# Altium project deserialize.PrjPcb
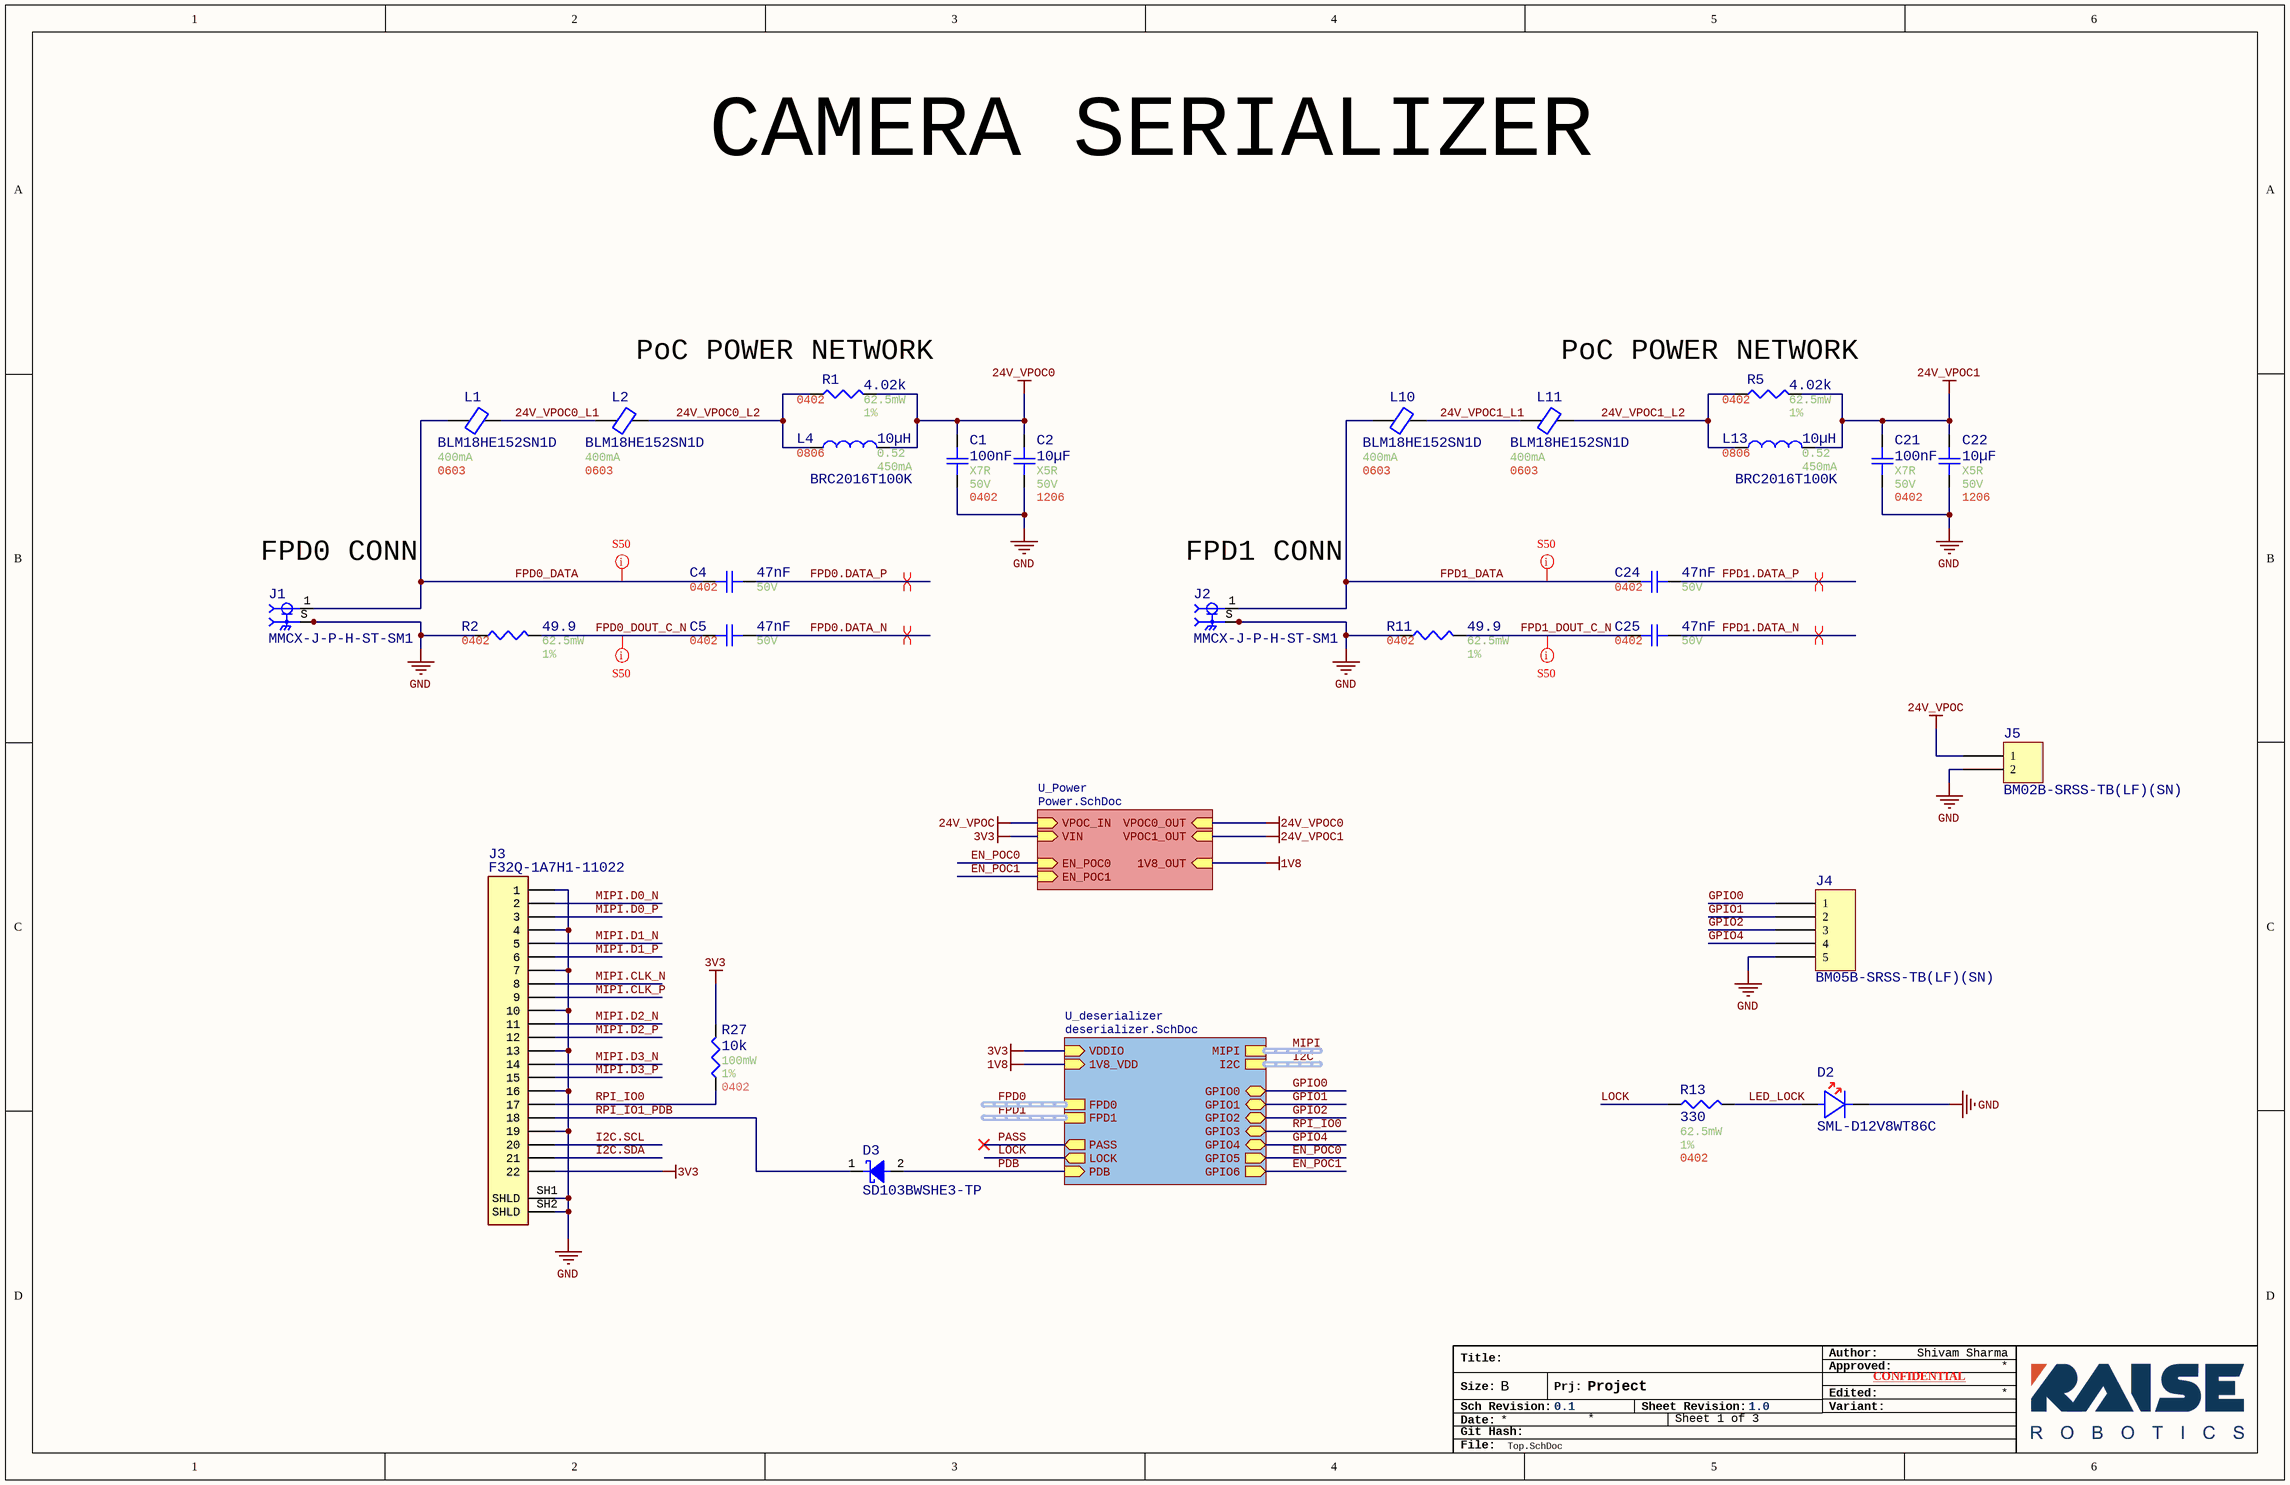
[diagram p0: Top.SchDoc]
SchRevision: 0.1; RR_PlaceNear: [{"paramVis":true,"a":{"refdes":"C6","srcUid":"OYVOCBFH","pin":"2"},"b":{"refdes":"U2","srcUid":"WNTCGATW","pin":"26"},"mm":5},{"paramVis":true,"a":{"refdes":"C7","srcUid":"CVMGOHLT","pin":"2"},"b":{"refdes":"U2","srcUid":"WNTCGATW","pin":"26"},"mm":5},{"paramVis":true,"a":{"refdes":"C8","srcUid":"TGPROSQA","pin":"2"},"b":{"refdes":"U2","srcUid":"WNTCGATW","pin":"26"},"mm":5},{"paramVis":true,"a":{"refdes":"C9","srcUid":"NERXMEEB","pin":"2"},"b":{"refdes":"U2","srcUid":"WNTCGATW","pin":"15"},"mm":5},{"paramVis":true,"a":{"refdes":"C10","srcUid":"PVQVEPHI","pin":"2"},"b":{"refdes":"U2","srcUid":"WNTCGATW","pin":"15"},"mm":5},{"paramVis":true,"a":{"refdes":"C11","srcUid":"IXZAQWUA","pin":"2"},"b":{"refdes":"U2","srcUid":"WNTCGATW","pin":"15"},"mm":5},{"paramVis":true,"a":{"refdes":"C12","srcUid":"SJIUUMFM","pin":"2"},"b":{"refdes":"U2","srcUid":"WNTCGATW","pin":"10"},"mm":5},{"paramVis":true,"a":{"refdes":"C13","srcUid":"VZIHORBA","pin":"2"},"b":{"refdes":"U2","srcUid":"WNTCGATW","pin":"10"},"mm":5},{"paramVis":true,"a":{"refdes":"C14","srcUid":"JKNMRYLV","pin":"2"},"b":{"refdes":"U2","srcUid":"WNTCGATW","pin":"10"},"mm":5},{"paramVis":true,"a":{"refdes":"C16","srcUid":"VAZDDXWB","pin":"2"},"b":{"refdes":"U2","srcUid":"WNTCGATW","pin":"25"},"mm":5},{"paramVis":true,"a":{"refdes":"C15","srcUid":"YTLVSWDQ","pin":"2"},"b":{"refdes":"U2","srcUid":"WNTCGATW","pin":"25"},"mm":5},{"paramVis":true,"a":{"refdes":"C18","srcUid":"XVSOHREA","pin":"2"},"b":{"refdes":"U2","srcUid":"WNTCGATW","pin":"16"},"mm":5},{"paramVis":true,"a":{"refdes":"C17","srcUid":"DALIXIOP","pin":"2"},"b":{"refdes":"U2","srcUid":"WNTCGATW","pin":"16"},"mm":5},{"paramVis":true,"a":{"refdes":"C20","srcUid":"WIZCYGLQ","pin":"2"},"b":{"refdes":"U2","srcUid":"WNTCGATW","pin":"11"},"mm":5},{"paramVis":true,"a":{"refdes":"C19","srcUid":"YZYSSQBB","pin":"2"},"b":{"refdes":"U2","srcUid":"WNTCGATW","pin":"11"},"mm":5},{"paramVis":true,"a":{"refdes":"C58","srcUid":"BEWWQTYO","pin":"1"},"b":{"refdes":"U2","srcUid":"WNTCGATW","pin":"9"},"mm":5},{"paramVis":true,"a":{"refdes":"C58","srcUid":"BEWWQTYO","pin":"2"},"b":{"refdes":"U2","srcUid":"WNTCGATW","pin":"11"},"mm":5}]; ProjectTitle: Project; PCBRevision: 0.0.1
2 sheets, 56 parts. Net scope: hierarchical (ports join the sheet entries above them; power ports are global).
Board file: Camera.PcbDoc
Sheets:
  Top.SchDoc
    U_Power = Power.SchDoc

## Sheet Top.SchDoc
size 431 x 279 mm; Author: Shivam Sharma; SheetNumber: 1; SheetTotal: 3; SheetRevision: 1.0

### Parts
C1  value 100nF  Temperature Coefficient: X7R  Voltage Rating: 50V  Case/Package: 0402  [Generic 0402 capacitor]  (hidden comment: GRT155R71H104KE01D)
C2  value 10µF  Temperature Coefficient: X5R  Voltage Rating: 50V  Case/Package: 1206  [Generic 1206 Capacitor]  (hidden comment: CL31A106MBHNNNE)
C4  value 47nF  Voltage Rating: 50V  Case/Package: 0402  [Generic 0402 capacitor]  (hidden comment: GRM155R71H473KE14D)
C5  value 47nF  Voltage Rating: 50V  Case/Package: 0402  [Generic 0402 capacitor]  (hidden comment: GRM155R71H473KE14D)
C21  value 100nF  Temperature Coefficient: X7R  Voltage Rating: 50V  Case/Package: 0402  [Generic 0402 capacitor]  (hidden comment: GRT155R71H104KE01D)
C22  value 10µF  Temperature Coefficient: X5R  Voltage Rating: 50V  Case/Package: 1206  [Generic 1206 Capacitor]  (hidden comment: CL31A106MBHNNNE)
C24  value 47nF  Voltage Rating: 50V  Case/Package: 0402  [Generic 0402 capacitor]  (hidden comment: GRM155R71H473KE14D)
C25  value 47nF  Voltage Rating: 50V  Case/Package: 0402  [Generic 0402 capacitor]  (hidden comment: GRM155R71H473KE14D)
D2  SML-D12V8WT86C  [FP-SML-D12-MFG]
D3  SD103BWSHE3-TP  [SOD-323]
J1  MMCX-J-P-H-ST-SM1  [MMCX-J-P-H-ST-SM1]
J2  MMCX-J-P-H-ST-SM1  [MMCX-J-P-H-ST-SM1]
J3  F32Q-1A7H1-11022  [F32Q-1A7H1-11022]
J4  BM05B-SRSS-TB(LF)(SN)  [JST BM05B-SRSS-TB]
J5  BM02B-SRSS-TB(LF)(SN)  [JST BM02B-SRSS-TB]
L1  BLM18HE152SN1D  Current Rating: 400mA  Case/Package: 0603  [0603_1.6x0.8x0.8mm_IND]
L2  BLM18HE152SN1D  Current Rating: 400mA  Case/Package: 0603  [0603_1.6x0.8x0.8mm_IND]
L4  BRC2016T100K  value 10µH  DCR: 0.52  Current Rating: 450mA  Case/Package: 0806  [0805_2.0x1.6x1.6mm_IND]
L10  BLM18HE152SN1D  Current Rating: 400mA  Case/Package: 0603  [0603_1.6x0.8x0.8mm_IND]
L11  BLM18HE152SN1D  Current Rating: 400mA  Case/Package: 0603  [0603_1.6x0.8x0.8mm_IND]
L13  BRC2016T100K  value 10µH  DCR: 0.52  Current Rating: 450mA  Case/Package: 0806  [0805_2.0x1.6x1.6mm_IND]
R1  value 4.02k  Power: 62.5mW  Tolerance: 1%  Case/Package: 0402  [Generic 0402 Resistor]  (hidden comment: RCA04024K02FKEDSR)
R2  value 49.9  Power: 62.5mW  Tolerance: 1%  Case/Package: 0402  [Generic 0402 Resistor]  (hidden comment: RMCA0402FT49R9-HP)
R5  value 4.02k  Power: 62.5mW  Tolerance: 1%  Case/Package: 0402  [Generic 0402 Resistor]  (hidden comment: RCA04024K02FKEDSR)
R11  value 49.9  Power: 62.5mW  Tolerance: 1%  Case/Package: 0402  [Generic 0402 Resistor]  (hidden comment: RMCA0402FT49R9-HP)
R13  value 330  Power: 62.5mW  Tolerance: 1%  Case/Package: 0402  [Generic 0402 Resistor]  (hidden comment: RMCF0402FT330R)
R27  value 10k  Power: 100mW  Tolerance: 1%  Case/Package: 0402  [Generic 0402 Resistor]  (hidden comment: RNCP0402FTD10K0)

### Sub-sheets
U_deserializer = deserializer.SchDoc (file not in this document): MIPI (harness MIPI), I2C (harness I2C), GPIO0 (bidir), GPIO1 (bidir), GPIO2 (bidir), GPIO3 (bidir), GPIO4 (bidir), GPIO5 (out), GPIO6 (out), LOCK (out), PASS (out), 1V8_VDD (in), FPD1 (harness FPD), FPD0 (harness FPD), VDDIO (in), PDB (in)
U_Power = Power.SchDoc: VIN (in), VPOC_IN (in), VPOC1_OUT (in), VPOC0_OUT (in), 1V8_OUT (in), EN_POC0 (in), EN_POC1 (in)

### Nets
1V8: sheet U_deserializer/1V8_VDD, sheet U_Power/1V8_OUT
3V3: J3.22 R27.2 ; sheet U_deserializer/VDDIO, sheet U_Power/VIN
24V_VPOC: J5.1 ; sheet U_Power/VPOC_IN
24V_VPOC0: C1.2 C2.2 L4.2 R1.2 ; sheet U_Power/VPOC0_OUT
24V_VPOC1: C21.2 C22.2 L13.2 R5.2 ; sheet U_Power/VPOC1_OUT
GND: C1.1 C2.1 C21.1 C22.1 D2.1(C) J1.S1 J1.S2 J1.S3 J1.S4 J2.S1 J2.S2 J2.S3 J2.S4 J3.1 J3.4 J3.7 J3.10 J3.13 J3.16 J3.19 J3.SH1(SHLD) J3.SH2(SHLD) J4.5 J5.2 R2.1 R11.1
24V_VPOC0_L1: L1.2 L2.1
24V_VPOC0_L2: L2.2 L4.1 R1.1
24V_VPOC1_L1: L10.2 L11.1
24V_VPOC1_L2: L11.2 L13.1 R5.1
EN_POC0: sheet U_deserializer/GPIO5, sheet U_Power/EN_POC0
EN_POC1: sheet U_deserializer/GPIO6, sheet U_Power/EN_POC1
FPD0.DATA_N: C5.1
FPD0.DATA_P: C4.1
FPD0_DATA: C4.2 J1.1 L1.1
FPD0_DOUT_C_N: C5.2 R2.2
FPD1.DATA_N: C25.1
FPD1.DATA_P: C24.1
FPD1_DATA: C24.2 J2.1 L10.1
FPD1_DOUT_C_N: C25.2 R11.2
GPIO0: J4.1 ; sheet U_deserializer/GPIO0
GPIO1: J4.2 ; sheet U_deserializer/GPIO1
GPIO2: J4.3 ; sheet U_deserializer/GPIO2
GPIO4: J4.4 ; sheet U_deserializer/GPIO4
I2C.SCL: J3.20
I2C.SDA: J3.21
LED_LOCK: D2.2(A) R13.2
LOCK: R13.1 ; sheet U_deserializer/LOCK
MIPI.CLK_N: J3.8
MIPI.CLK_P: J3.9
MIPI.D0_N: J3.2
MIPI.D0_P: J3.3
MIPI.D1_N: J3.5
MIPI.D1_P: J3.6
MIPI.D2_N: J3.11
MIPI.D2_P: J3.12
MIPI.D3_N: J3.14
MIPI.D3_P: J3.15
PASS: sheet U_deserializer/PASS
PDB: D3.2(A) ; sheet U_deserializer/PDB
RPI_IO0: J3.17 R27.1 ; sheet U_deserializer/GPIO3
RPI_IO1_PDB: D3.1(C) J3.18

### Buses and harness runs
harness FPD0 = sheet U_deserializer/FPD0
harness FPD1 = sheet U_deserializer/FPD1
harness I2C = sheet U_deserializer/I2C
harness MIPI = sheet U_deserializer/MIPI

### Layout directives
net class S50: FPD0_DATA, FPD0_DOUT_C_N, FPD1_DATA, FPD1_DOUT_C_N
differential pair: FPD0.DATA_N, FPD0.DATA_P, FPD1.DATA_N, FPD1.DATA_P

### Notes on the sheet
- CAMERA SERIALIZER
- (near R1) PoC POWER NETWORK
- (near R5) PoC POWER NETWORK
- (near J1) FPD0 CONN
- (near J2) FPD1 CONN
- Title:
- Author:
- Approved:
- Size:
- Date:
- Git Hash:
- Sch Revision:
- B
- Prj:
- Sheet Revision:
- Variant:
- Edited:
- CONFIDENTIAL
- File:
- (in symbol CMP-002-00135-2) S

### Library data of the parts
C1 C21 = CMP-001-00084-12: Ceramic Capacitor, Multilayer, Ceramic, 50V, 10% +Tol, 10% -Tol, X7R, 15% TC, 0.1uF, Surface Mount, 0402; Multilayer: Yes; Terminal Finish: Nickel; Capacitor Type: Ceramic; Package Shape: Rectangular; Reach SVHC Compliant: Yes; Max Operating Temperature: 125°C; RoHS Compliant: Yes; Termination: Wraparound; Packaging: Tape and Reel; AECQ: Yes; Pins: 2; Dielectric Material: Ceramic; Min Operating Temperature: -55°C; Tolerance: 10%; Mounting Technology: Surface Mount
C2 C22 = CMP-001-00092-6: Ceramic Capacitor, Multilayer, Ceramic, 50V, 20% +Tol, 20% -Tol, X5R, 15% TC, 10uF, Surface Mount, 1206; AECQ: No; Multilayer: Yes; Reach SVHC Compliant: Yes; Package Shape: Rectangular; Temperature Characteristics Code: X5R; RoHS Compliant: Yes; Max Operating Temperature: 85°C; Mounting Technology: Surface Mount; Capacitor Type: Ceramic; Pins: 2; Packaging: Tape and Reel; Terminal Finish: Nickel; Tolerance: 20%; Termination: Wraparound; Dielectric Material: Ceramic; JESD-609 Code: e3; Min Operating Temperature: -55°C
C4 C5 C24 C25 = CMP-001-00113-1: 50V 47nF X7R ±10% 0402 Multilayer Ceramic Capacitors MLCC - SMD/SMT ROHS; AECQ: No; Mounting Technology: SMD; Tolerance: 10%; Pins: 2; Min Operating Temperature: -55°C; Max Operating Temperature: 125°C; Capacitor Type: Ceramic
D2 = CMP-007-00036-1: Red 630nm LED Indication - Discrete 2.2V 0603 (1608 Metric); Case/Package: 0603; Forward Voltage: 2.2V; Colour: Red; Pins: 2
D3 = CMP-004-00038-1: Rectifier Diode, Schottky, 1 Phase, 1 Element, 0.35A, 30V V(RRM), Silicon; Reverse Recovery Time: 10ns; Forward Voltage: 370mV; Forward Current: 350mA; Min Operating Temperature: -55°C; Max Operating Temperature: 125°C; RoHS Compliant: Yes; Min Breakdown Voltage: 30V; Max Output current: 350mA; Case/Package: SOD-323; Pins: 2
J1 J2 = CMP-002-00135-2: RF / Coaxial Connector, MMCX Coaxial, Straight Jack, Surface Mount Vertical, 50 ohm; Manufacturer: Samtec; Max Current Rating: 1.5A; Voltage Rating: 335V; Gender: Female; Connector Type: MMCX, Socket; Manufacturer Series: MMCX; Length: 3.45mm; Mounting Technology: Surface Mount; Pins: 2; Min Operating Temperature: -65°C; Case/Package: MMCX SMD; Max Operating Temperature: 125°C
J3 = CMP-002-00137-2: FPC/FFC Connector Socket 22 Position 0.5mm Top Contact Solder Right Angle Surface Mount T/R; Manufacturer: Amphenol; Manufacturer Series: F32Q; Connector Type: FPC; Voltage Rating: 50V; Gender: Female; Max Current Rating: 500mA; Max Operating Temperature: 105°C; Length: 20.8mm; Height: 2.9mm; RoHS Compliant: Yes; Pins: 22; Case/Package: 22-ZIF_0.5mm; Width: 5.5mm; Min Operating Temperature: -40°C; Pitch: 0.5mm
J4 = BM05B-SRSS-TB(LF)(SN): CONN HEADER SMD 5POS 1MM; Manufacturer: JST Sales America Inc.; Current Rating (Amps): 0.7A; Material Flammability Rating: UL94 V-0; Number of Positions: 5; Number of Positions Loaded: All; Pitch - Mating: 0.039" (1.00mm); Shrouding: Shrouded - 4 Wall; Style: Board to Cable/Wire; Voltage Rating: 50V; Part Number: BM05B-SRSS-TB(LF)(SN); ComponentLink1Description: Datasheet; ComponentLink1URL: http://www.jst-mfg.com/product/pdf/eng/eSR.pdf; ComponentLink2Description: DigiKey Link; ComponentLink2URL: http://digikey.com/product-detail/en/jst-sales-america-inc/BM05B-SRSS-TB-LF-SN/455-1791-1-ND/926862; Connector Type: Header; Contact Finish - Mating: Tin; Contact Finish - Post: Tin; Contact Material: Copper Alloy; Contact Shape: Square; Contact Type: Male Pin; Fastening Type: Push-Pull; Features: Solder Retention; Insulation Color: Natural; Insulation Height: 0.167" (4.25mm); Insulation Material: Polyamide (PA), Nylon; LastUpdated: 1/12/2020 10:14:00 PM; Lifecycle Status: Active; Minimum Order: 1; Mounting Type: Surface Mount; Number of Rows: 1; Operating Temperature: -25°C ~ 85°C; Packaging: TapeAndReel; PartId: 18; Part Status: Active; Price: 0.35; Series: SR; Supplier 1: DigiKey; Supplier Part Number 1: 455-1791-1-ND; Termination: Solder
J5 = BM02B-SRSS-TB(LF)(SN): CONN HEADER SMD 2POS 1MM; Manufacturer: JST Sales America Inc.; Current Rating (Amps): 0.7A; Material Flammability Rating: UL94 V-0; Number of Positions: 2; Number of Positions Loaded: All; Pitch - Mating: 0.039" (1.00mm); Shrouding: Shrouded - 4 Wall; Style: Board to Cable/Wire; Voltage Rating: 50V; Part Number: BM02B-SRSS-TB(LF)(SN); ComponentLink1Description: Datasheet; ComponentLink1URL: http://www.jst-mfg.com/product/pdf/eng/eSR.pdf; ComponentLink2Description: DigiKey Link; ComponentLink2URL: http://digikey.com/product-detail/en/jst-sales-america-inc/BM02B-SRSS-TB-LF-SN/455-1788-1-ND/926859; Connector Type: Header; Contact Finish - Mating: Tin; Contact Finish - Post: Tin; Contact Material: Copper Alloy; Contact Shape: Square; Contact Type: Male Pin; Fastening Type: Push-Pull; Features: Solder Retention; Insulation Color: Natural; Insulation Height: 0.167" (4.25mm); Insulation Material: Polyamide (PA), Nylon; LastUpdated: 1/12/2020 10:11:04 PM; Lifecycle Status: Active; Minimum Order: 1; Mounting Type: Surface Mount; Number of Rows: 1; Operating Temperature: -25°C ~ 85°C; Packaging: TapeAndReel; PartId: 12; Part Status: Active; Price: 0.22; Series: SR; Supplier 1: DigiKey; Supplier Part Number 1: 455-1788-1-ND; Termination: Solder
L1 L2 L10 L11 = CMP-006-00026-1: Ferrite Beads Multi-Layer 1.5KOhm 25% 100MHz 500mA 500mOhm DCR 0603 T/R; Current - Saturation: 13.3A; AECQ: no; DCR: 20.5m; Shileded: Yes; Height: 800µm; Max Operating Temperature: 125°C; Pins: 2; Tolerance: 25%; Min Operating Temperature: -55°C
L4 L13 = CMP-006-00025-2: IND 10UH 20% 3.1A SHD; Shileded: Yes; Tolerance: 10%; Self Resonant Frequency: 35MHz; Current - Saturation: 3.3A; AECQ: No; Pins: 2; Height: 1.6mm; Min Operating Temperature: -40°C; Max Operating Temperature: 105°C
R1 R5 = CMP-009-00241-1: Fixed Resistor, Metal Glaze/Thick Film, 0.063W, 4020ohm, 50V, 1% +/-Tol, Surface Mount, 0402; Manufacturer Part Number: Blank; AECQ: Yes; Pins: 2; Voltage Rating: 50V; Max Operating Temperature: 155°C; Min Operating Temperature: -55°C; Mounting Technology: SMD
R2 R11 = CMP-009-00240-1: RES, 0402, 49.9 ohm, 1%, 0.1W, AUTO; AECQ: Yes; Voltage Rating: 50V; Min Operating Temperature: -55°C; Mounting Technology: SMD; Manufacturer Part Number: RMCA0402FT49R9-HP; Max Operating Temperature: 155°C; Pins: 2
R13 = CMP-009-00225-1: Res Thick Film 0402 330 Ohm 1% 0.063W ±100ppm/°C Molded SMD Paper T/R; AECQ: Yes; Mounting Technology: Surface Mount; Max Operating Temperature: 155°C; RoHS Compliant: Yes; Pins: 2; Min Operating Temperature: -55°C
R27 = CMP-009-00242-1: Fixed Resistor, Thin Film, 0.1W, 10000ohm, 50V, 1% +/-Tol, 100ppm/Cel, Surface Mount, 0402; Manufacturer Part Number: Blank; AECQ: Yes; Pins: 2; Max Operating Temperature: 155°C; Voltage Rating: 50V; Mounting Technology: SMD; Min Operating Temperature: -55°C

## Sheet Power.SchDoc: POWER
size 431 x 279 mm; SheetNumber: 2; SheetTotal: 3; SheetRevision: 1.0
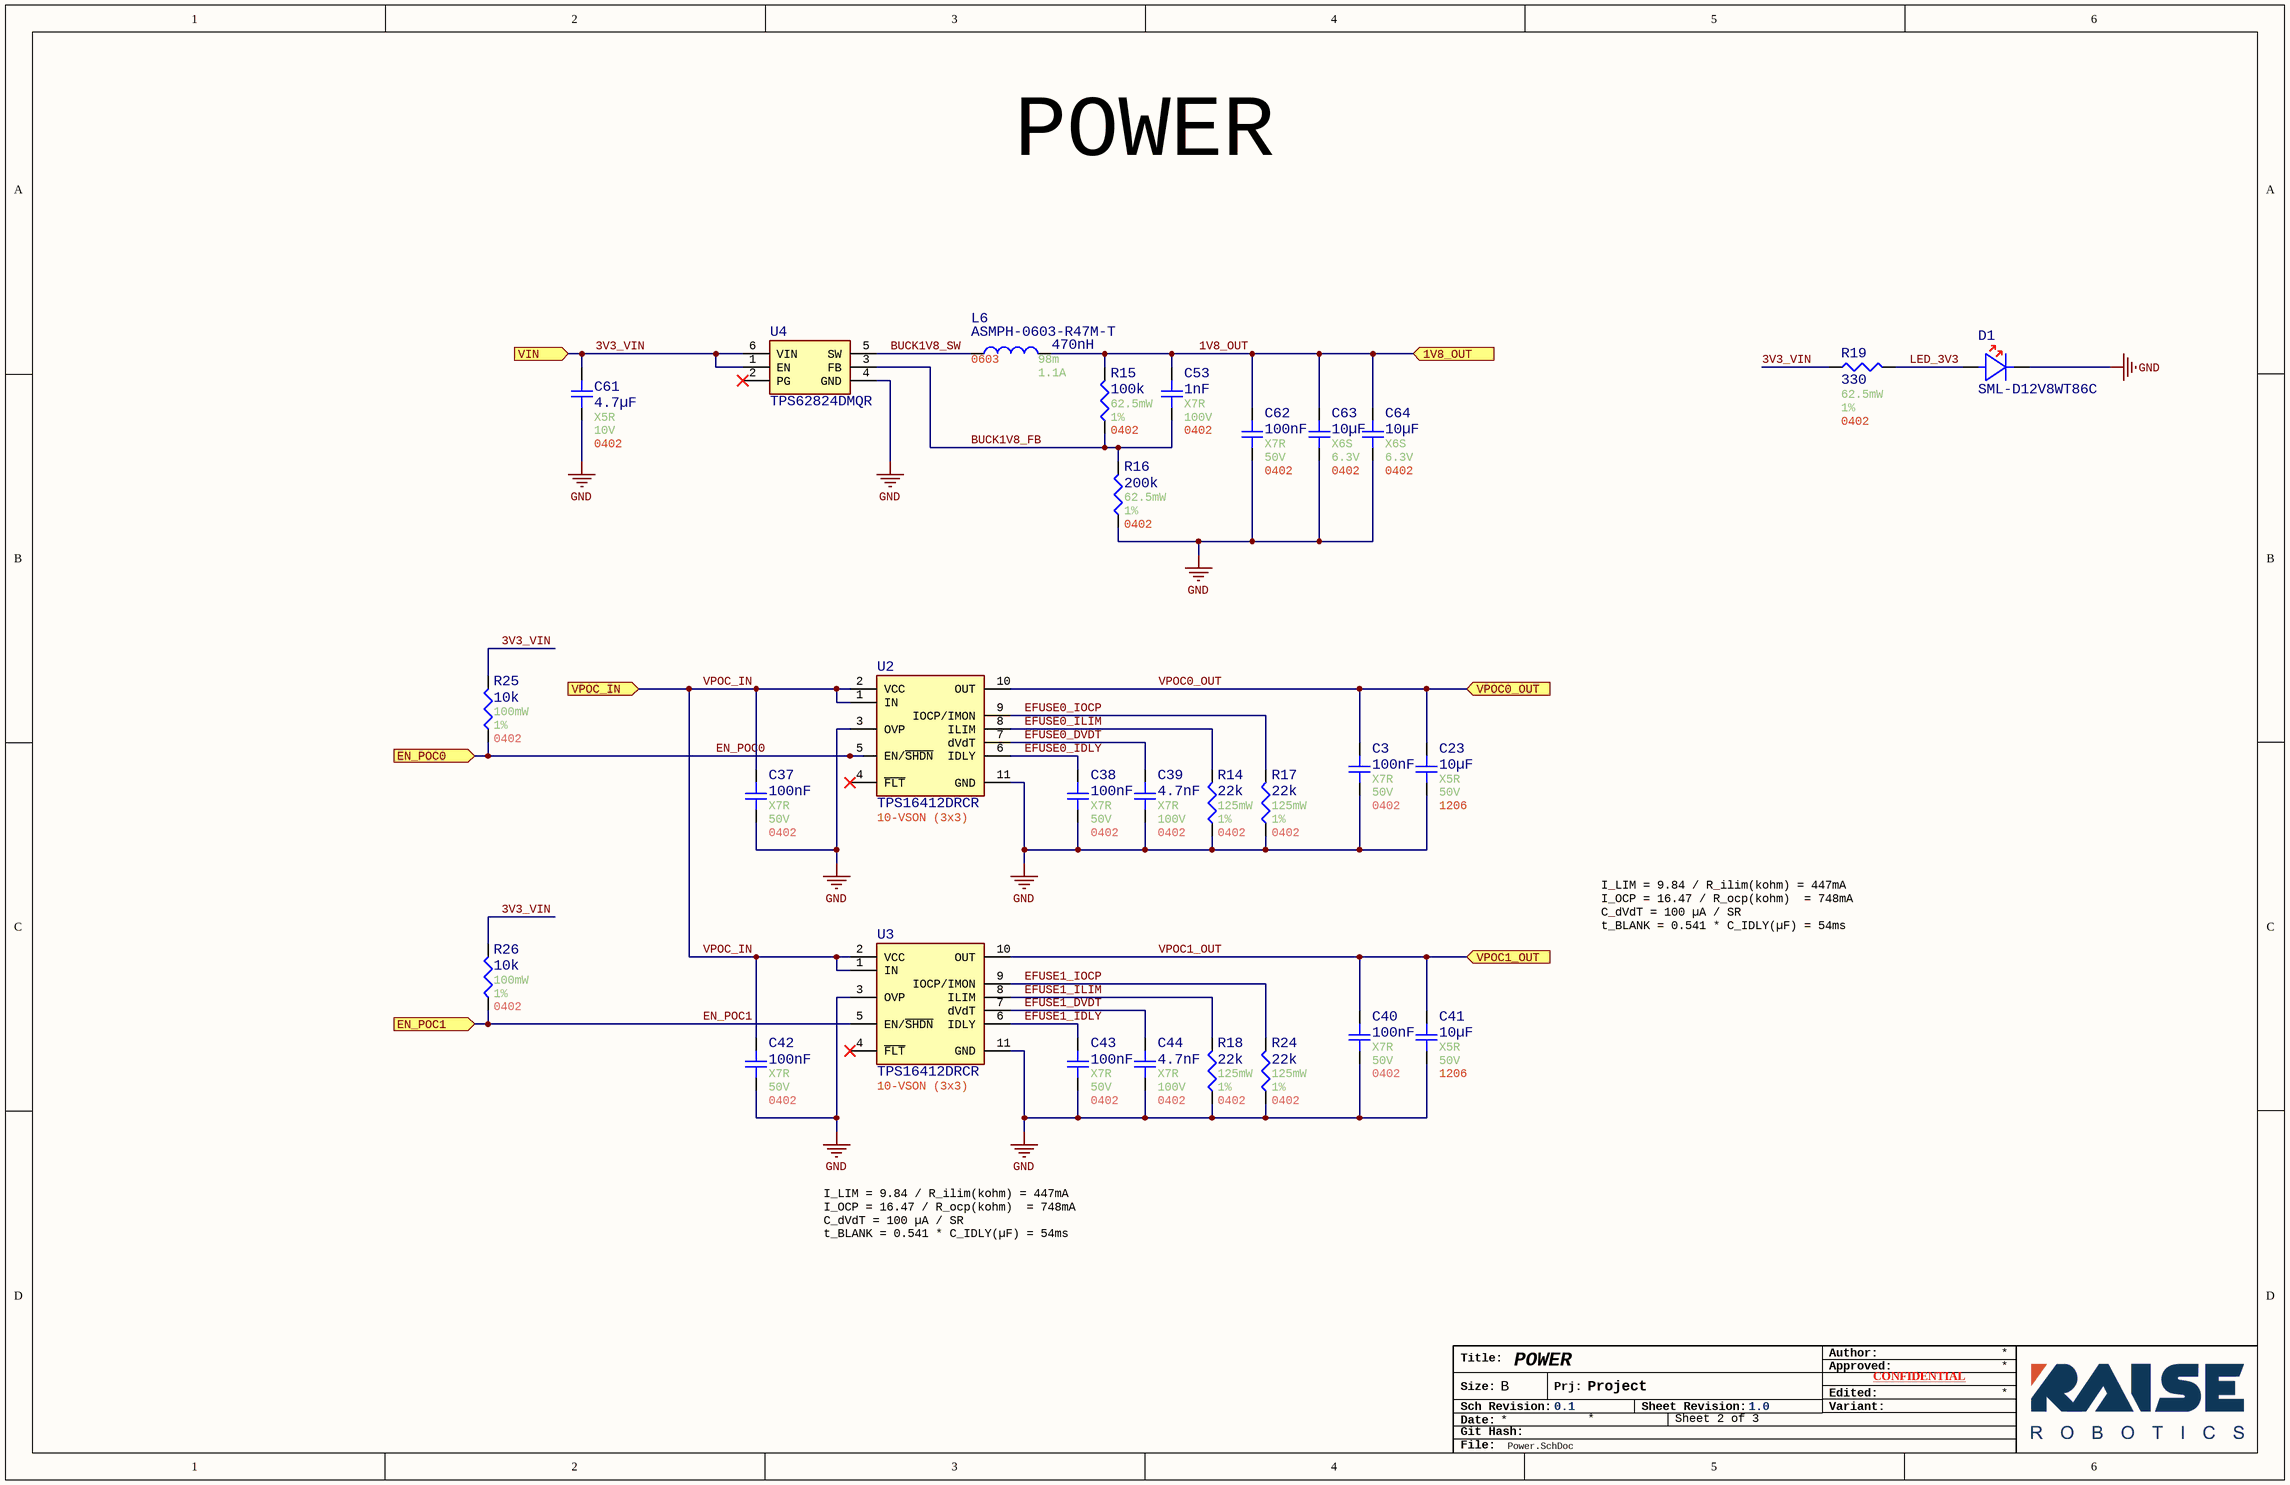
[diagram p1: Power.SchDoc]

### Parts
C3  value 100nF  Temperature Coefficient: X7R  Voltage Rating: 50V  Case/Package: 0402  [Generic 0402 capacitor]  (hidden comment: GRT155R71H104KE01D)
C23  value 10µF  Temperature Coefficient: X5R  Voltage Rating: 50V  Case/Package: 1206  [Generic 1206 Capacitor]  (hidden comment: CL31A106MBHNNNE)
C37  value 100nF  Temperature Coefficient: X7R  Voltage Rating: 50V  Case/Package: 0402  [Generic 0402 capacitor]  (hidden comment: GRT155R71H104KE01D)
C38  value 100nF  Temperature Coefficient: X7R  Voltage Rating: 50V  Case/Package: 0402  [Generic 0402 capacitor]  (hidden comment: GRT155R71H104KE01D)
C39  value 4.7nF  Temperature Coefficient: X7R  Voltage Rating: 100V  Case/Package: 0402  [Generic 0402 capacitor]  (hidden comment: GCM155R72A472KA37D)
C40  value 100nF  Temperature Coefficient: X7R  Voltage Rating: 50V  Case/Package: 0402  [Generic 0402 capacitor]  (hidden comment: GRT155R71H104KE01D)
C41  value 10µF  Temperature Coefficient: X5R  Voltage Rating: 50V  Case/Package: 1206  [Generic 1206 Capacitor]  (hidden comment: CL31A106MBHNNNE)
C42  value 100nF  Temperature Coefficient: X7R  Voltage Rating: 50V  Case/Package: 0402  [Generic 0402 capacitor]  (hidden comment: GRT155R71H104KE01D)
C43  value 100nF  Temperature Coefficient: X7R  Voltage Rating: 50V  Case/Package: 0402  [Generic 0402 capacitor]  (hidden comment: GRT155R71H104KE01D)
C44  value 4.7nF  Temperature Coefficient: X7R  Voltage Rating: 100V  Case/Package: 0402  [Generic 0402 capacitor]  (hidden comment: GCM155R72A472KA37D)
C53  value 1nF  Temperature Coefficient: X7R  Voltage Rating: 100V  Case/Package: 0402  [Generic 0402 capacitor]  (hidden comment: GCM155R72A102KA37J)
C61  value 4.7µF  Temperature Coefficient: X5R  Voltage Rating: 10V  Case/Package: 0402  [Generic 0402 capacitor]  (hidden comment: GRT155R61A475ME13D)
C62  value 100nF  Temperature Coefficient: X7R  Voltage Rating: 50V  Case/Package: 0402  [Generic 0402 capacitor]  (hidden comment: GRT155R71H104KE01D)
C63  value 10µF  Temperature Coefficient: X6S  Voltage Rating: 6.3V  Case/Package: 0402  [Generic 0402 capacitor]  (hidden comment: GRT155C80J106ME13J)
C64  value 10µF  Temperature Coefficient: X6S  Voltage Rating: 6.3V  Case/Package: 0402  [Generic 0402 capacitor]  (hidden comment: GRT155C80J106ME13J)
D1  SML-D12V8WT86C  [FP-SML-D12-MFG]
L6  ASMPH-0603-R47M-T  value 470nH  DCR: 98m  Current Rating: 1.1A  Case/Package: 0603  [0603_1.6x0.8x0.8mm_IND]
R14  value 22k  Power: 125mW  Tolerance: 1%  Case/Package: 0402  [Generic 0402 Resistor]  (hidden comment: AC0402FR-7W22KL)
R15  value 100k  Power: 62.5mW  Tolerance: 1%  Case/Package: 0402  [Generic 0402 Resistor]  (hidden comment: WR04X1003FTL)
R16  value 200k  Power: 62.5mW  Tolerance: 1%  Case/Package: 0402  [Generic 0402 Resistor]  (hidden comment: 560112110041)
R17  value 22k  Power: 125mW  Tolerance: 1%  Case/Package: 0402  [Generic 0402 Resistor]  (hidden comment: AC0402FR-7W22KL)
R18  value 22k  Power: 125mW  Tolerance: 1%  Case/Package: 0402  [Generic 0402 Resistor]  (hidden comment: AC0402FR-7W22KL)
R19  value 330  Power: 62.5mW  Tolerance: 1%  Case/Package: 0402  [Generic 0402 Resistor]  (hidden comment: RMCF0402FT330R)
R24  value 22k  Power: 125mW  Tolerance: 1%  Case/Package: 0402  [Generic 0402 Resistor]  (hidden comment: AC0402FR-7W22KL)
R25  value 10k  Power: 100mW  Tolerance: 1%  Case/Package: 0402  [Generic 0402 Resistor]  (hidden comment: RNCP0402FTD10K0)
R26  value 10k  Power: 100mW  Tolerance: 1%  Case/Package: 0402  [Generic 0402 Resistor]  (hidden comment: RNCP0402FTD10K0)
U2  TPS16412DRCR  Case/Package: 10-VSON (3x3)  [VSON-10_3x3x1.0mm_P0.5mm]
U3  TPS16412DRCR  Case/Package: 10-VSON (3x3)  [VSON-10_3x3x1.0mm_P0.5mm]
U4  TPS62824DMQR  [VSON_HR-6_1.5x1.5x1.0mm_P0.5mm]

### Ports
1V8_OUT (in), EN_POC0 (in), EN_POC1 (in), VIN (in), VPOC0_OUT (in), VPOC1_OUT (in), VPOC_IN (in)

### Nets
1V8_OUT: C53.2 C62.1 C63.2 C64.2 L6.2 R15.2 ; port 1V8_OUT  [project net 1V8]
3V3_VIN: C61.1 R19.1 R25.2 R26.2 U4.1(EN) U4.6(VIN) ; port VIN  [project net 3V3]
GND: C3.1 C23.1 C37.1 C38.1 C39.1 C40.1 C41.1 C42.1 C43.1 C44.1 C61.2 C62.2 C63.1 C64.1 D1.1(C) R14.1 R16.1 R17.1 R18.1 R24.1 U2.3(OVP) U2.11(GND) U3.3(OVP) U3.11(GND) U4.4(GND)
VPOC0_OUT: C3.2 C23.2 U2.10(OUT) ; port VPOC0_OUT  [project net 24V_VPOC0]
VPOC1_OUT: C40.2 C41.2 U3.10(OUT) ; port VPOC1_OUT  [project net 24V_VPOC1]
VPOC_IN: C37.2 C42.2 U2.1(IN) U2.2(VCC) U3.1(IN) U3.2(VCC) ; port VPOC_IN  [project net 24V_VPOC]
BUCK1V8_FB: C53.1 R15.1 R16.2 U4.3(FB)
BUCK1V8_SW: L6.1 U4.5(SW)
EFUSE0_DVDT: C39.2 U2.7(dVdT)
EFUSE0_IDLY: C38.2 U2.6(IDLY)
EFUSE0_ILIM: R14.2 U2.8(ILIM)
EFUSE0_IOCP: R17.2 U2.9(IOCP/IMON)
EFUSE1_DVDT: C44.2 U3.7(dVdT)
EFUSE1_IDLY: C43.2 U3.6(IDLY)
EFUSE1_ILIM: R18.2 U3.8(ILIM)
EFUSE1_IOCP: R24.2 U3.9(IOCP/IMON)
EN_POC0: R25.1 U2.5(EN/~{SHDN}) ; port EN_POC0
EN_POC1: R26.1 U3.5(EN/~{SHDN}) ; port EN_POC1
LED_3V3: D1.2(A) R19.2

Not connected (* = marked no-connect by the designer): U2 4(~{FLT})*; U3 4(~{FLT})*; U4 2(PG)*

### Notes on the sheet
- POWER
- I_LIM = 9.84 / R_ilim(kohm) = 447mA
  I_OCP = 16.47 / R_ocp(kohm)  = 748mA
  C_dVdT = 100 µA / SR
  t_BLANK = 0.541 * C_IDLY(µF) = 54ms
- Title:
- Author:
- Approved:
- Size:
- Date:
- Git Hash:
- Sch Revision:
- B
- Prj:
- Sheet Revision:
- Variant:
- Edited:
- CONFIDENTIAL
- File:

### Library data of the parts
C3 C37 C38 C40 C42 C43 C62 = CMP-001-00084-12: as C1 on sheet Top; Terminal Finish: Nickel; Capacitor Type: Ceramic; Package Shape: Rectangular; Reach SVHC Compliant: Yes; Max Operating Temperature: 125°C; RoHS Compliant: Yes; Termination: Wraparound; Packaging: Tape and Reel; AECQ: Yes; Pins: 2; Dielectric Material: Ceramic; Min Operating Temperature: -55°C; Tolerance: 10%; Mounting Technology: Surface Mount
C23 C41 = CMP-001-00092-6: as C2 on sheet Top; Reach SVHC Compliant: Yes; Package Shape: Rectangular; Temperature Characteristics Code: X5R; RoHS Compliant: Yes; Max Operating Temperature: 85°C; Mounting Technology: Surface Mount; Capacitor Type: Ceramic; Pins: 2; Packaging: Tape and Reel; Terminal Finish: Nickel; Tolerance: 20%; Termination: Wraparound; Dielectric Material: Ceramic; JESD-609 Code: e3; Min Operating Temperature: -55°C
C39 C44 = CMP-001-00110-2: Ceramic Capacitor, Multilayer, Ceramic, 100V, 10% +Tol, 10% -Tol, X7R, 15% TC, 0.0047uF, Surface Mount, 0402; AECQ: Yes; Min Operating Temperature: -55°C; Mounting Technology: SMD; Capacitor Type: Ceramic; Max Operating Temperature: 125°C; Tolerance: 10%; RoHS Compliant: Yes; Pins: 2
C53 = CMP-001-00101-2: Ceramic Capacitor, Multilayer, Ceramic, 100V, 10% +Tol, 10% -Tol, X7R, 15% TC, 0.001uF, Surface Mount, 0402; AECQ: Yes; Min Operating Temperature: -55°C; Max Operating Temperature: 125°C; Pins: 2; Mounting Technology: SMD; Tolerance: 10%; Capacitor Type: Ceramic
C61 = CMP-001-00085-5: Ceramic Capacitor, Multilayer, Ceramic, 10V, 20% +Tol, 20% -Tol, X5R, 15% TC, 4.7uF, Surface Mount, 0402; Multilayer: Yes; Tolerance: 0%; Reach SVHC Compliant: Yes; Tolerance (fill in as +-): 20%; Packaging: Tape and Reel; Dielectric Material: Ceramic; Mounting Technology: Surface Mount; RoHS Compliant: Yes; Tolerance  (fill in as +-): 20%; Rated DC Voltage (URdc): 10V; Package Shape: Rectangular; Termination: Wraparound; Pins: 2; Max Operating Temperature: 85°C; Capacitor Type: Ceramic; Min Operating Temperature: -55°C; AECQ: Yes
C63 C64 = CMP-001-00108-2: Multilayer Ceramic Capacitors MLCC - SMD/SMT 0402 10uF 6.3VDC 20% X6S AEC-Q200; AECQ: Yes; Mounting Technology: Surface Mount; RoHS Compliant: Yes; Pins: 2; Min Operating Temperature: -55°C; Capacitor Type: Ceramic; Tolerance: 20%; Max Operating Temperature: 105°C
D1 = CMP-007-00036-1: as D2 on sheet Top; Case/Package: 0603; Forward Voltage: 2.2V; Colour: Red; Pins: 2
L6 = CMP-006-00028-1: Inductor Power Shielded Multi-Layer 0.47uH 20% 1MHz Ferrite 1.1A 0.19Ohm DCR 0603 T/R; Self Resonant Frequency: 180MHz; AECQ: No; Shileded: Yes; Current - Saturation: 1.8A; Pins: 2; Max Operating Temperature: 125°C; Min Operating Temperature: -55°C; Tolerance: 20%; Height: 800µm; Mounting Technology: SMT
R14 R17 R18 R24 = CMP-009-00193-3: Fixed Resistor, Metal Glaze/thick Film, 0.125W, 22000ohm, 75V, 1% +/-Tol, 100ppm/Cel, Surface Mount, 0402; AECQ: Yes; Mounting Technology: SMD; Min Operating Temperature: -55°C; Max Operating Temperature: 155°C; Manufacturer Part Number: AC0402FR-7W22KL; Pins: 2
R15 = CMP-009-00188-7: Fixed Resistor, Metal Glaze/thick Film, 0.0625W, 100000ohm, 50V, 1% +/-Tol, 100ppm/Cel, Surface Mount, 0402; Manufacturer Part Number: Blank; Package Height: 0.35mm; AECQ: No; Temperature Coefficient (ppm/Cel): 100; Package Length: 1mm; Package Width: 0.5mm; Additional Feature: LASER TRIMMABLE; Rated Temperature: 70°C; Construction: Chip; RoHS Compliant: Yes; Resistor Type: FIXED RESISTOR; Min Operating Temperature: -55°C; Pins: 2; Technology: METAL GLAZE/THICK FILM; Reach SVHC Compliant: Yes; Working Voltage: 50V; JESD-609 Code: e3; Mounting Technology: Surface Mount; Max Operating Temperature: 155°C; Termination: Wraparound; Terminal Finish: Nickel; Packaging: Tape and Reel; Package Shape: Rectangular
R16 = CMP-009-00248-1: Resistor, 200K, 0.1W, Thick Film, 0402;; AECQ: Yes; Voltage Rating: 50V; Pins: 2; Max Operating Temperature: 155°C; Mounting Technology: Surface Mount; Min Operating Temperature: -55°C; RoHS Compliant: Yes
R19 = CMP-009-00225-1: as R13 on sheet Top; Mounting Technology: Surface Mount; Max Operating Temperature: 155°C; RoHS Compliant: Yes; Pins: 2; Min Operating Temperature: -55°C
R25 R26 = CMP-009-00242-1: as R27 on sheet Top; Pins: 2; Max Operating Temperature: 155°C; Voltage Rating: 50V; Mounting Technology: SMD; Min Operating Temperature: -55°C
U2 U3 = CMP-031-00018-1: 2.7-V to 40-V 152-mΩ 1.8-A eFuse with output power limiting 10-VSON -40 to 125; Min Supply Voltage: 2.7V; AECQ: No; Max Supply Voltage: 40V; Max Operating Temperature: 125°C; MPN: TPS16412DRCR; Mounting Technology: SMT; Min Operating Temperature: -40°C; Pins: 10
U4 = CMP-019-00068-1: IC REG BUCK ADJ 1A 6VSON Buck Switching Regulator IC Positive Adjustable 0.6V 1 Output 1A 6-VFDFN; Min Supply Voltage: 2.4V; Max Supply Voltage: 5.5V; Frequency: 2.2MHz; Output Current: 1A; Case/Package: 6-VSON-HR (1.5x1.5); Pins: 6; Min Operating Temperature: -40°C; RoHS Compliant: Yes; Max Operating Temperature: 125°C; Mounting Technology: SMD

## Nets that join several sheets
3V3: Top (J3.22 R27.2), Power (6 pins)
24V_VPOC: Top (J5.1), Power (6 pins)
24V_VPOC0: Top (C1.2 C2.2 L4.2 R1.2), Power (C3.2 C23.2 U2.10)
24V_VPOC1: Top (C21.2 C22.2 L13.2 R5.2), Power (C40.2 C41.2 U3.10)
GND: Top (26 pins), Power (25 pins)

## Assembly variants
Main: not fitted R7 R7 R9